# EAGLE design drobithotshoe_v2.2 (EAGLE 7.5.0)

## Sheet 1 of 3
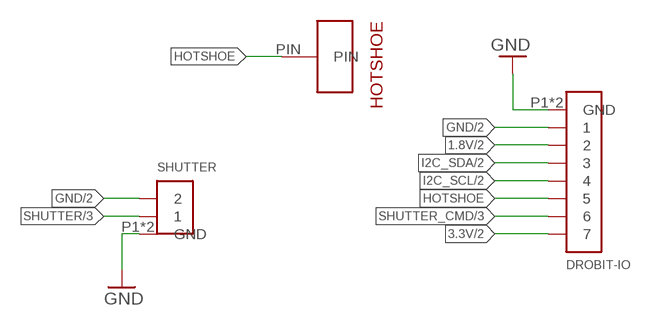
[diagram p0: schematic, sheet 1]

### Parts
DROBIT-IO  CONN_7-1  [JST-GH-7]
HOTSHOE  ZAPATA-MILMAX  [MILMAX-807-22-001-30-000101]
SHUTTER  CONN_2-1-GH-VERT  [JST-GH-2-V]

### Nets
1.8V: DROBIT-IO.2 ; also sheet 2
3.3V: DROBIT-IO.7 ; also sheet 2
GND: DROBIT-IO.1 DROBIT-IO.P1(GND) DROBIT-IO.P2(GND) SHUTTER.2 SHUTTER.P1(GND) SHUTTER.P2(GND) ; also sheet 2,3
HOTSHOE: DROBIT-IO.5 HOTSHOE.PIN
I2C_SCL: DROBIT-IO.4 ; also sheet 2
I2C_SDA: DROBIT-IO.3 ; also sheet 2
SHUTTER: SHUTTER.1 ; also sheet 3
SHUTTER_CMD: DROBIT-IO.6 ; also sheet 3

## Sheet 2 of 3: IMU
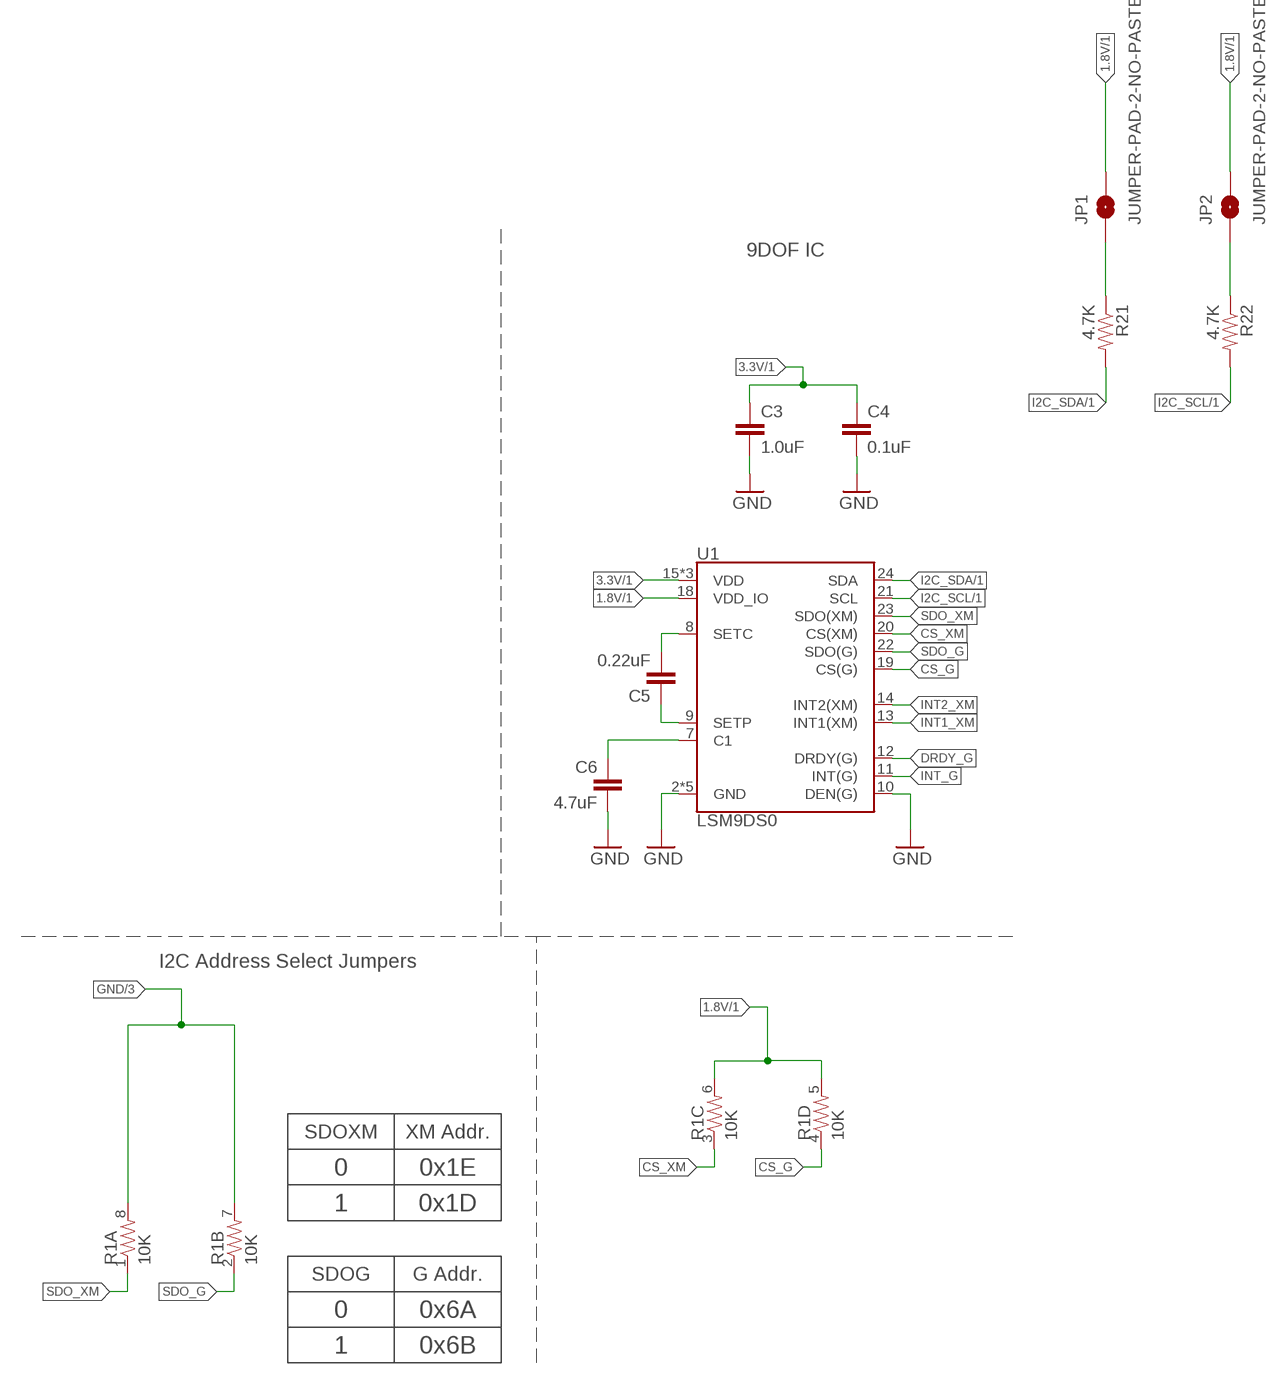
[diagram p1: schematic, sheet 2]

### Parts
C3  1.0uF  1.0UF-16V-10%(0603)  [0603-CAP]
C4  0.1uF  0.1UF-25V(+80/-20%)(0603)  [0603-CAP]
C5  0.22uF  0.22UF-16V-10%(0603)  [0603-CAP]
C6  4.7uF  4.7UF-6.3V-10%(0603)0603  [0603-CAP]
JP1  JUMPER-PAD-2-NO-PASTE  [PAD-JUMPER-2-NO_NO_SILK_PASTE]
JP2  JUMPER-PAD-2-NO-PASTE  [PAD-JUMPER-2-NO_NO_SILK_PASTE]
R1  10K  RESISTOR-ARRAY0603-ARV  [0603-ARV]
R21  4.7K  4.7KOHM-1/10W-1%(0603)  [0603-RES]
R22  4.7K  4.7KOHM-1/10W-1%(0603)  [0603-RES]
U1  LSM9DS0  [LGA-24]

### Nets
1.8V: JP1.2 JP2.2 R1.5 R1.6 U1.18(VDD_IO) ; also sheet 1
3.3V: C3.1 C4.1 U1.15(VDD) U1.16(VDD) U1.17(VDD) ; also sheet 1
CS_G: R1.4 U1.19(CS(G))
CS_XM: R1.3 U1.20(CS(XM))
DRDY_G: U1.12(DRDY(G))
GND: C3.2 C4.2 C6.2 R1.7 R1.8 U1.2(GND) U1.3(GND) U1.4(GND) U1.5(GND) U1.6(GND) U1.10(DEN(G)) ; also sheet 1,3
I2C_SCL: R22.2 U1.21(SCL) ; also sheet 1
I2C_SDA: R21.2 U1.24(SDA) ; also sheet 1
INT1_XM: U1.13(INT1(XM))
INT2_XM: U1.14(INT2(XM))
INT_G: U1.11(INT(G))
N$1: C5.1 U1.9(SETP)
N$2: C5.2 U1.8(SETC)
N$3: C6.1 U1.7(C1)
N$4: JP1.1 R21.1
N$5: JP2.1 R22.1
SDO_G: R1.2 U1.22(SDO(G))
SDO_XM: R1.1 U1.23(SDO(XM))

### Notes on the sheet
- 9DOF IC
- I2C Address Select Jumpers
- SDOXM | XM Addr.
- 0 | 0x1E
- 1 | 0x1D
- SDOG | G Addr.
- 0 | 0x6A
- 1 | 0x6B

## Sheet 3 of 3: Trigger
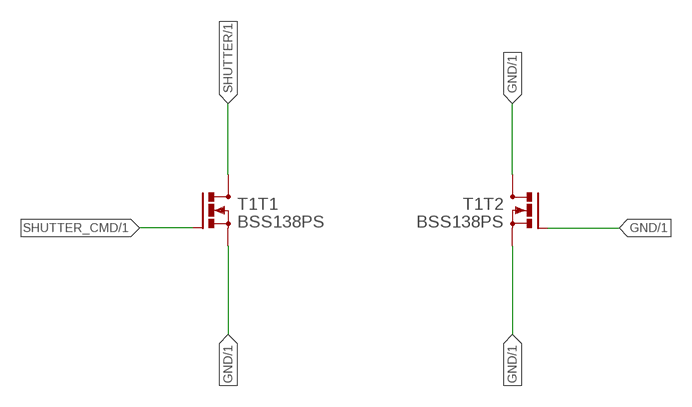
[diagram p2: schematic, sheet 3]

### Parts
T1  BSS138PS  [SOT363]

### Nets
GND: T1.1(T1:S) T1.3(T2:D) T1.4(T2:S) T1.5(T2:G) ; also sheet 1,2
SHUTTER: T1.6(T1:D) ; also sheet 1
SHUTTER_CMD: T1.2(T1:G) ; also sheet 1

## Library data of the parts
C3 = SparkFun-Capacitors:1.0UF-16V-10%(0603): CAP-00868; PARTNO: 810-CGA3E1X7R1E105K; PROD_ID: CAP-00868
C4 = SparkFun-Capacitors:0.1UF-25V(+80/-20%)(0603): CAP-00810 Ceramic Standard decoupling cap; PARTNO: 810-CGA3E2X7R1E104K; PROD_ID: CAP-00810
C5 = SparkFun-Capacitors:0.22UF-16V-10%(0603): CAP-07822; PARTNO: 810-C1608X7R1C224K; PROD_ID: CAP-07822
C6 = SparkFun-Capacitors:4.7UF-6.3V-10%(0603): CAP-08280; PARTNO: 81-GRM18R60J475KE19D; PROD_ID: CAP-08280
DROBIT-IO = jst-gh:CONN_7-1; PARTNO: 455-1569-1-ND
HOTSHOE = zapata:ZAPATA-MILMAX; PARTNO: NO_PONER
JP1 JP2 = SparkFun-Passives:JUMPER-PAD-2-NO; PARTNO: N/A
R1 = SparkFun-Resistors:RESISTOR-ARRAY: Array Chip Resistor Source: RS Component / Phycomp; PARTNO: 667-EXB-38V103JV
R21 R22 = SparkFun-Resistors:4.7KOHM-1/10W-1%(0603): RES-07857; PARTNO: 667-ERJ-3GEYJ472V; PROD_ID: RES-07857
SHUTTER = jst-gh:CONN_2-1; PARTNO: 455-1564-1-ND
T1 = BSS138PS:BSS138PS; AVAILABILITY: Good; DESCRIPTION: MOSFET n-channel dual 60V 320mA TSSOP6; MF: NXP Semiconductors; MP: BSS138PS; PACKAGE: TSSOP-6 NXP Semiconductors; PARTNO: 771-BSS138BKS115; PRICE: 0.19 USD
U1 = SparkFun-DigitalIC:LSM9DS0: LSM9DS0 3D Accelerometer, 3D Gyroscope, 3D Magnetomter Features: 3 acceleration channels, 3 angular rate channels, 3 magnetic field channels ±2/±4/±6/±8/±16 g linear acceleration full scale ±2/±4/±8/±12 gauss magnetic full scale ±245/±500/±2000 dps angular rate full scale 16-bit data output SPI / I2C serial interfaces Analog supply voltage 2.4 V to 3.6 V Power-down mode / low-power mode Programmable interrupt generators Embedded self-test Embedded temperature sensor Embedded FIFO Position and motion detection functions Click/double-click recognition; PARTNO: 497-13902-1-ND

## Board
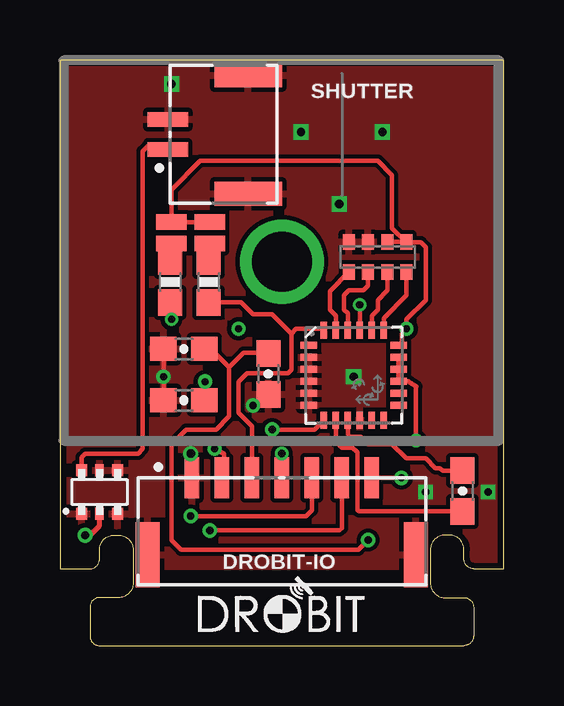
[diagram p3: board, top side]
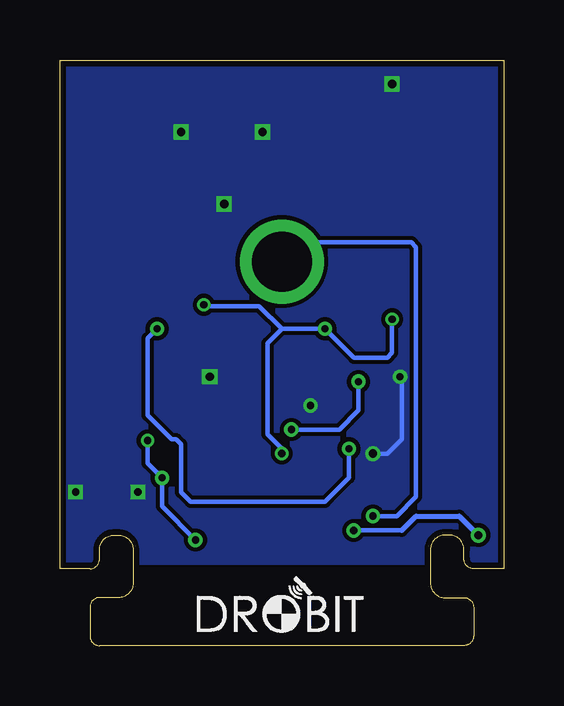
[diagram p4: board, bottom side, seen from below]

Size 18.5 x 24.4 mm. Coordinates in mm from the lower left corner, seen from the top.
Outline: 18.5,3.2 18.5,24.4 0,24.4 0,3.2 1.25,3.2 arc90 1.65,3.6 1.65,4 arc-90 2.25,4.6 2.45,4.6 arc-90 3.05,4 3.05,2.6 arc-90 2.45,2 1.65,2 arc90 1.25,1.6 1.25,0.4 arc90 1.65,0 16.85,0 arc90 17.25,0.4 17.25,1.6 arc90 16.85,2 16.05,2 arc-90 15.45,2.6 15.45,4 arc-90 16.05,4.6 16.25,4.6 arc-90 16.85,4 16.85,3.6 arc90 17.25,3.2 18.5,3.2
Copper layers (1*16): Top 0.035mm / dielectric 1.55mm / Bottom 0.035mm
Design rules "EU_35um_DRONING *": minimum track width 0.18mm, minimum drill 0.3mm, track to track 0.175mm, track to pad 0.175mm, pad to pad 0.175mm, via to via 0.175mm, smd to smd 0mil, copper to edge 0.25mm, drill to drill 0.35mm, minimum pad ring 0.175mm, minimum via ring 0.125mm, stop-mask expansion 0mil, vias tented up to drill 2mm, thermal gap 0.2mm

### Footprints (pad centres in the part's own frame; a part is rotated, then mirrored left to right if it is on the bottom)
0603-CAP = smd 1.1 x 1: 1 -0.85,0; 2 0.85,0
JST-GH-7 = smd 0.6 x 1.7: 1 3.75,-5.45; 2 2.5,-5.45; 3 1.25,-5.45; 4 0,-5.45; 5 -1.25,-5.45; 6 -2.5,-5.45; 7 -3.75,-5.45 | smd 1 x 2.7: P1 5.6,-2.25; P2 -5.6,-2.25
MILMAX-807-22-001-30-000101 = drill 2.5 pad 3.5: PIN 0,0
PAD-JUMPER-2-NO_NO_SILK_PASTE = smd 0.635 x 1.27: 1 -0.45,0; 2 0.45,0
0603-ARV = smd 0.5 x 0.65: 1 -1.2,-0.625; 2 -0.4,-0.625; 3 0.4,-0.625; 4 1.2,-0.625; 5 1.2,0.625; 6 0.4,0.625; 7 -0.4,0.625; 8 -1.2,0.625
0603-RES = smd 1.1 x 1: 1 -0.85,0; 2 0.85,0
JST-GH-2-V = smd 0.6 x 1.7: 1 0.625,-5.55; 2 -0.625,-5.55 | smd 1 x 2.8: P1 2.475,-2.2; P2 -2.475,-2.2
SOT363 = smd 0.5 x 0.5: 1 -0.9,0.75; 3 -0.9,-0.75; 4 0.9,-0.75; 6 0.9,0.75 | smd 0.5 x 0.4: 2 -0.9,0; 5 0.9,0
LGA-24 = smd 0.7 x 0.29: 1 -1.875,1.25; 2 -1.875,0.75; 3 -1.875,0.25; 4 -1.875,-0.25; 5 -1.875,-0.75; 6 -1.875,-1.25; 13 1.875,-1.25; 14 1.875,-0.75; 15 1.875,-0.25; 16 1.875,0.25; 17 1.875,0.75; 18 1.875,1.25 | smd 0.29 x 0.7: 7 -1.25,-1.875; 8 -0.75,-1.875; 9 -0.25,-1.875; 10 0.25,-1.875; 11 0.75,-1.875; 12 1.25,-1.875; 19 1.25,1.875; 20 0.75,1.875; 21 0.25,1.875; 22 -0.25,1.875; 23 -0.75,1.875; 24 -1.25,1.875

### Placement (x,y rotation side)
C3  8.69,11.32 270 top
C4  5.17,12.36 180 top
C5  16.79,6.44 270 top
C6  5.17,10.22 180 top
DROBIT-IO  9.25,1.54 180 top
HOTSHOE  9.25,16 180 bottom
JP1  6.25,17.2 90 top
JP2  4.65,17.2 90 top
R1  13.25,16.2 0 top
R21  6.2,15.15 270 top
R22  4.6,15.15 270 top
SHUTTER  10.05,21.3 270 top
T1  1.65,6.4 90 top
U1  12.25,11.26 0 top

### Tracks (layer width: path | path; a pad name or v marks a point on that pad's centre or on a via)
1.8V  (via drill 0.3 pad 0.6)
  Top 0.18: DROBIT-IO.2 6.84,6.99 6.85,7 6.85,8 v6.45,8.2 | U1.18 14.25,12.63 14.25,13 v14.45,13.2 14.45,13.6 15.25,14.4 15.25,16.6 15.05,16.8 14.47,16.8 | 14.47,16.8 R1.5 R1.6 | 14.47,16.8 14.45,16.8 13.85,17.4 13.85,19.6 13.25,20.2 5.85,20.2 4.65,19 JP2.2 JP1.2
  Bottom 0.18: v6.45,8.2 6.45,7 7.45,6 13.05,6 13.45,6.4 13.45,8.4 13.65,8.6 13.85,8.6 14.85,9.6 14.85,12.8 v14.45,13.2
3.3V  (via drill 0.3, 0.3 pad 0.6)
  Top 0.18: 6.21,12.17 C4.1 | C4.1 6.29,12.36 7.05,11.6 | 7.05,11.6 7.05,9.55 6.5,9 5.25,9 4.65,8.4 4.65,4.4 5.05,4 12.45,4 v12.85,4.4 | DROBIT-IO.7 v14.24,6.99 | v14.85,8.55 14.85,10.8 | 6.05,12.39 C4.1 | 7.05,11.6 7.65,12.2 8.66,12.2 C3.1
  Top 0.2: 14.85,10.8 14.54,11 U1.15 U1.16 U1.17
  Bottom 0.18: v12.85,4.4 14.25,5.8 v14.25,6.98 v14.24,6.99 14.85,7.6 v14.85,8.55
CS_G
  Top 0.18: U1.19 13.5,13.65 14.45,14.6 R1.4
CS_XM
  Top 0.18: R1.3 13.65,14.8 13.25,14.4 13.25,14 13,13.75 U1.20
GND  (via drill 0.3 pad 0.6, 0.35, 0.35 pad 0.6)
  Top 0.18: C4.2 v4.32,11.2 C6.2 | DROBIT-IO.1 5.5,7.95 v5.45,8 | C3.2 8.52,10.47 v8.05,10
  Bottom 0.18: v5.45,8 4.85,8 4.25,8.6 4.25,11.13 v4.32,11.2
  other vias: 12.25,11.2 15.25,6.4 17.85,6.4 4.65,23.4 10.05,21.4 13.45,21.4 11.65,18.4
  pour Bottom: 0.15,24.3 0.15,8.5 18.35,8.5 18.35,24.3
  pour Top: 0.15,24.3 0.15,3.3 18.35,3.3 18.35,24.3
  pour Bottom: 0.15,24.5 0.15,3.5 18.35,3.5 18.35,24.5
HOTSHOE  (via drill 0.3 pad 0.6)
  Top 0.18: DROBIT-IO.5 10.5,5.65 10.25,5.4 v5.45,5.4
  Bottom 0.18: v5.45,5.4 4.45,5.4 3.65,6.2 3.65,16.6 3.85,16.8 8.45,16.8 HOTSHOE.PIN
I2C_SCL  (via drill 0.3, 0.3 pad 0.6)
  Top 0.18: 12.45,13.08 U1.21 | 12.45,13.08 12.45,13 | 12.45,13.08 12.45,13.35 12.5,13.4 v12.5,14.2 | v4.65,13.6 4.65,14.25 R22.2 | DROBIT-IO.4 v9.25,8
  Bottom 0.18: 9.25,13.2 10.2,14.15 12.45,14.15 v12.5,14.2 | 9.25,13.2 v7.45,13.2 6.25,12 4.85,12 4.65,12.2 v4.65,13.6 | v9.25,8 9.25,8.2 9.85,8.8 9.85,12.6 9.25,13.2
I2C_SDA
  Top 0.18: DROBIT-IO.3 8,9.15 7.45,9.7 7.45,11 7.8,11.35 9.5,11.35 9.65,11.5 9.65,13 | U1.24 10.94,13.2 9.85,13.2 9.65,13 | R21.2 7.55,14.3 8.05,13.8 8.85,13.8 9.65,13
N$1
  Top 0.18: C5.1 15.96,7.29 15.85,7.4 15.65,7.4 15.25,7.8 14.45,7.8 13.85,8.4 12.85,8.4 12.55,8.7 12.1,8.7 12,8.8 U1.9
N$2
  Top 0.18: C5.2 12.46,5.59 12.4,5.65 12.4,8.05 12.2,8.25 11.75,8.25 11.5,8.5 U1.8
N$3  (via drill 0.3 pad 0.6)
  Top 0.18: C6.1 6.02,10.77 v6.05,11 | v8.85,9 10.62,9 U1.7
  Bottom 0.18: v6.05,11 6.05,9.8 6.85,9 v8.85,9
N$4
  Top 0.18: R21.1 6.2,16.7 JP1.1
N$5
  Top 0.18: R22.1 4.6,16.7 JP2.1
SDO_G
  Top 0.18: R1.2 12.85,15 12.65,14.8 12.05,14.8 11.85,14.6 11.85,14 12,13.85 U1.22
SDO_XM
  Top 0.18: R1.1 11.25,14.77 11.25,14 11.5,13.75 U1.23
SHUTTER
  Top 0.18: T1.6 0.9,7.85 1.05,8 3.25,8 3.45,8.2 3.45,20.6 3.65,20.8 4.47,20.8 SHUTTER.1
SHUTTER_CMD  (via drill 0.3 pad 0.6, 0.35 pad 0.6)
  Top 0.18: DROBIT-IO.6 11.75,4.9 11.65,4.8 v6.25,4.8
  Top 0.2: v1.05,4.6 1.25,4.6 1.65,5 T1.2
  Bottom 0.18: v6.25,4.8 4.25,4.8
  Bottom 0.2: 1.65,5.2 v1.05,4.6 1.85,5.4 3.65,5.4 4.25,4.8